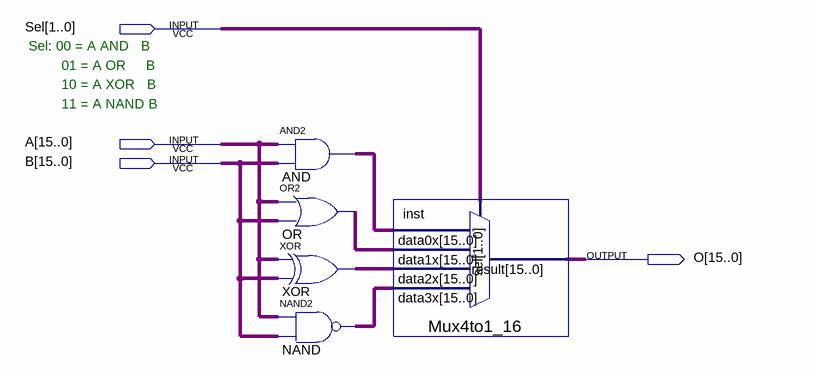
[diagram p0: schematic sheet]
// Quartus schematic ALU2.bdf as structural Verilog: 5 symbols, 4 pins
module ALU2 (
  input  [1:0] Sel,
  input  [15:0] A,
  input  [15:0] B,
  output [15:0] O
);

  wire [15:0] AND_out, NAND_out, OR_out, XOR_out;

  assign AND_out = A & B;  // AND2 AND, 16 bits wide
  assign OR_out = A | B;  // OR2 OR, 16 bits wide
  assign XOR_out = A ^ B;  // XOR XOR, 16 bits wide
  assign NAND_out = ~(A & B);  // NAND2 NAND, 16 bits wide
  Mux4to1_16 inst (.data3x(NAND_out), .data2x(XOR_out), .data1x(OR_out), .data0x(AND_out), .sel(Sel), .result(O));

  // Notes on the sheet:
  //   Sel: 00 = A AND   B  
  //    01 = A OR     B 
  //    10 = A XOR   B 
  //    11 = A NAND B 
endmodule
